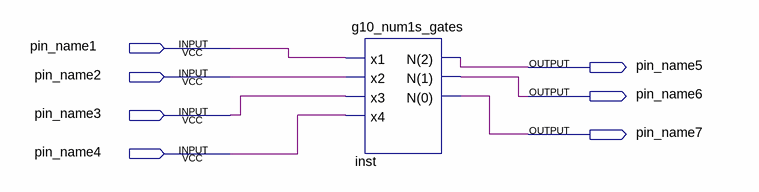
[diagram p0: schematic sheet]
// Quartus schematic g10_num1s_symbolDiagram.bdf as structural Verilog: 1 symbols, 7 pins
module g10_num1s_symbolDiagram (
  input  pin_name1,
  input  pin_name2,
  input  pin_name3,
  input  pin_name4,
  output pin_name5,
  output pin_name6,
  output pin_name7
);

  g10_num1s_gates inst (
    .x1(pin_name1), .x2(pin_name2), .x3(pin_name3), .x4(pin_name4), .\N(2) (pin_name5), .\N(1) (pin_name6),
    .\N(0) (pin_name7));
endmodule
